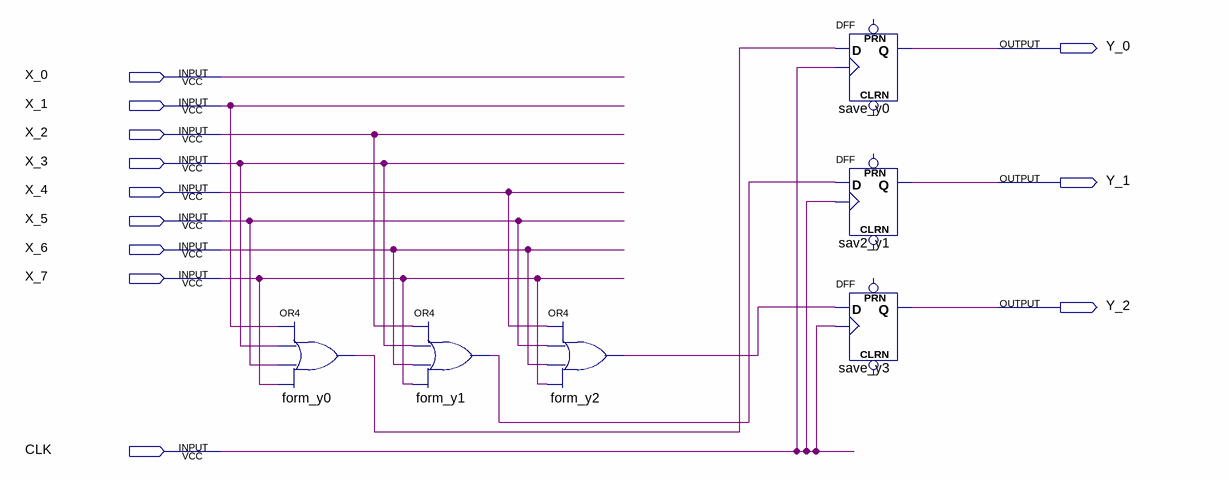
[diagram p0: schematic sheet]
// Quartus schematic Lab1.bdf as structural Verilog: 6 symbols, 12 pins
module Lab1 (
  input  X_0,
  input  X_1,
  input  X_2,
  input  X_3,
  input  X_4,
  input  X_5,
  input  X_6,
  input  X_7,
  input  CLK,
  output Y_0,
  output Y_1,
  output Y_2
);

  wire form_y0_out, form_y1_out, form_y2_out;

  or form_y0 (form_y0_out, X_1, X_3, X_5, X_7);
  or form_y1 (form_y1_out, X_2, X_3, X_6, X_7);
  or form_y2 (form_y2_out, X_4, X_5, X_6, X_7);
  DFF save_y0 (.CLK(CLK), .D(form_y0_out), .Q(Y_0));  // open: CLRN, PRN
  DFF sav2_y1 (.CLK(CLK), .D(form_y1_out), .Q(Y_1));  // open: CLRN, PRN
  DFF save_y3 (.CLK(CLK), .D(form_y2_out), .Q(Y_2));  // open: CLRN, PRN
endmodule
